# Altium schematic sheet loom-side-panel-left.SchDoc
size 297 x 209 mm
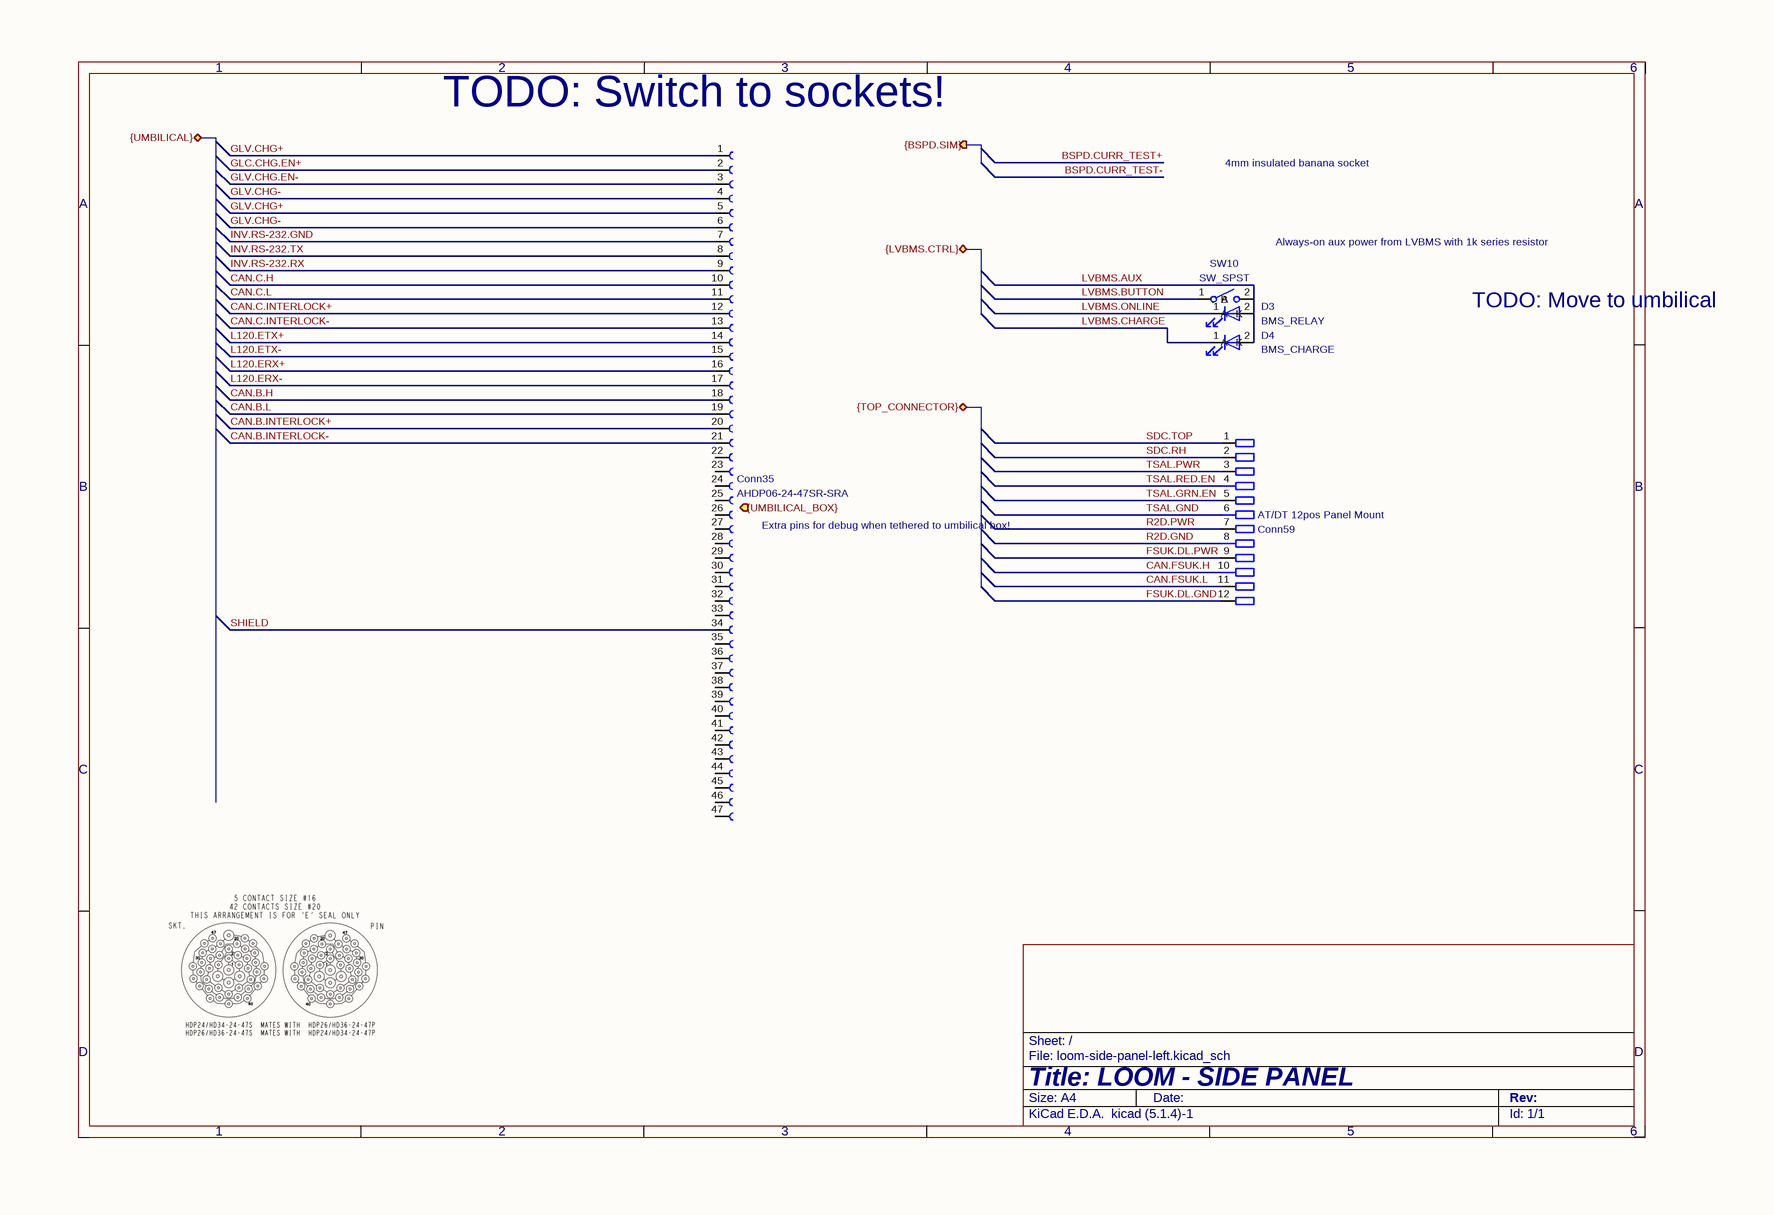
[diagram p0: loom-side-panel-left.SchDoc]

## Parts
Conn35  P/N: AHDP06-24-47SR-SRA  (hidden comment: AMPHENOL-47P-Recepticle)
Conn59  P/N: AT/DT 12pos Panel Mount  (hidden comment: AMPHENOL-21P-Pannel)
D3  BMS_RELAY
D4  BMS_CHARGE
SW10  SW_SPST

## Ports
{BSPD.SIM} (out), {LVBMS.CTRL} (bidir), {TOP_CONNECTOR} (bidir), {UMBILICAL_BOX} (in), {UMBILICAL} (bidir)

## Nets
CAN.B.H: Conn35.18
CAN.B.INTERLOCK+: Conn35.20
CAN.B.INTERLOCK-: Conn35.21
CAN.B.L: Conn35.19
CAN.C.H: Conn35.10
CAN.C.INTERLOCK+: Conn35.12
CAN.C.INTERLOCK-: Conn35.13
CAN.C.L: Conn35.11
CAN.FSUK.H: Conn59.10
CAN.FSUK.L: Conn59.11
FSUK.DL.GND: Conn59.12
FSUK.DL.PWR: Conn59.9
GLC.CHG.EN+: Conn35.2
GLV.CHG+: Conn35.1 Conn35.5
GLV.CHG-: Conn35.4 Conn35.6
GLV.CHG.EN-: Conn35.3
INV.RS-232.GND: Conn35.7
INV.RS-232.RX: Conn35.9
INV.RS-232.TX: Conn35.8
L120.ERX+: Conn35.16
L120.ERX-: Conn35.17
L120.ETX+: Conn35.14
L120.ETX-: Conn35.15
LVBMS.AUX: D3.2(A) D4.2(A) SW10.2(B)
LVBMS.BUTTON: SW10.1(A)
LVBMS.CHARGE: D4.1(K)
LVBMS.ONLINE: D3.1(K)
R2D.GND: Conn59.8
R2D.PWR: Conn59.7
SDC.RH: Conn59.2
SDC.TOP: Conn59.1
SHIELD: Conn35.34
TSAL.GND: Conn59.6
TSAL.GRN.EN: Conn59.5
TSAL.PWR: Conn59.3
TSAL.RED.EN: Conn59.4

Not connected (* = marked no-connect by the designer): Conn35 22 23 24 25 26 27 28 29 30 31 32 33 35 36 37 38 39 40 41 42 43 44 45 46 47

## Notes on the sheet
- (near Conn35) TODO: Switch to sockets!
- 4mm insulated
  banana socket
- Always-on
  aux power
  from LVBMS
  with 1k
  series resistor
- TODO: Move to umbilical
- (near Conn35) Extra pins for
  debug when tethered
  to umbilical box!
- 1
- 2
- 3
- 4
- 5
- 6
- A
- B
- C
- D
- Title: LOOM - SIDE PANEL
- File: loom-side-panel-left.kicad_sch
- Sheet: /
- KiCad E.D.A.  kicad (5.1.4)-1
- Size: A4
- Date:
- Rev:
- Id: 1/1

## Library data of the parts
Conn59 = Deutsch_DTM_12P_Pin: Value: AMPHENOL-21P-Pannel
D3 D4 = LED: Description: Light emitting diode
  D3: Value: BMS_RELAY
  D4: Value: BMS_CHARGE
SW10 = SW_SPST: Description: Single Pole Single Throw (SPST) switch; Value: SW_SPST
Conn35 = AMPHENOL-47P-Recepticle: Value: AMPHENOL-47P-Recepticle